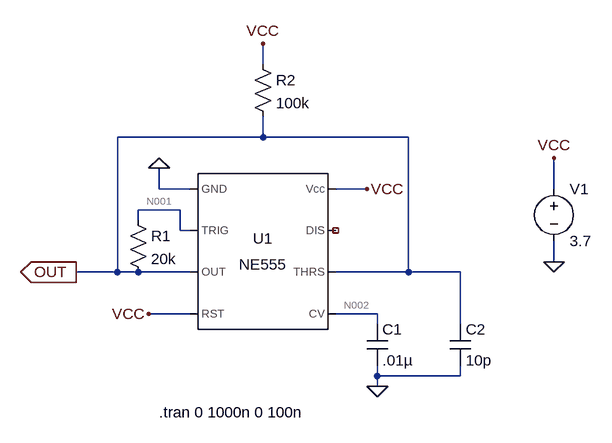
[diagram p0: schematic Draft1.asc]
Draft1.asc, the LTspice schematic file:
Version 4
SHEET 1 880 680
WIRE 208 -128 208 -160
WIRE 208 -16 208 -48
WIRE 208 -16 -16 -16
WIRE 432 -16 208 -16
WIRE 48 64 48 32
WIRE 96 64 48 64
WIRE 368 64 320 64
WIRE 656 64 656 16
WIRE 80 96 16 96
WIRE 16 112 16 96
WIRE 80 128 80 96
WIRE 96 128 80 128
WIRE 656 176 656 144
WIRE -16 192 -16 -16
WIRE -16 192 -80 192
WIRE 16 192 -16 192
WIRE 96 192 16 192
WIRE 432 192 432 -16
WIRE 432 192 320 192
WIRE 512 192 432 192
WIRE 96 256 32 256
WIRE 384 256 320 256
WIRE 384 272 384 256
WIRE 512 272 512 192
WIRE 384 352 384 336
WIRE 512 352 512 336
WIRE 512 352 384 352
WIRE 384 368 384 352
FLAG 384 368 0
FLAG 656 176 0
FLAG 656 16 VCC
FLAG 368 64 VCC
FLAG 32 256 VCC
FLAG -80 192 OUT
IOPIN -80 192 Out
FLAG 48 32 0
FLAG 208 -160 VCC
SYMBOL Misc\\NE555 208 160 R0
SYMATTR InstName U1
SYMBOL cap 368 272 R0
SYMATTR InstName C1
SYMATTR Value .01µ
SYMBOL cap 496 272 R0
SYMATTR InstName C2
SYMATTR Value 10p
SYMBOL voltage 656 48 R0
WINDOW 123 0 0 Left 0
WINDOW 39 0 0 Left 0
SYMATTR InstName V1
SYMATTR Value 3.7
SYMBOL res 0 96 R0
SYMATTR InstName R1
SYMATTR Value 20k
SYMBOL res 192 -144 R0
SYMATTR InstName R2
SYMATTR Value 100k
TEXT 48 408 Left 2 !.tran 0 1000n 0 100n

The netlist it stands for:
* Draft1.asc
XU1 0 N001 OUT VCC N002 OUT NC_01 VCC NE555  ; pins GND TRIG OUT RST CV THRS DIS Vcc
C1 N002 0 .01µ
C2 OUT 0 10p
V1 VCC 0 3.7
R1 N001 OUT 20k
R2 VCC OUT 100k
.tran 0 1000n 0 100n
.lib NE555.sub
.backanno
.end

* Results of the author's LTspice run, read from the files saved beside the schematic
* Operating Point, zero values left out:
*   V(n001) = 3.7 V
*   V(n002) = 2.467 V
*   V(vcc) = 3.7 V
*   V(out) = 3.7 V
*   I(R1) = -3.7 nA
*   I(R2) = 222.4 pA
*   I(V1) = -1.189 mA
*   Ix(u1:1) = -1.189 mA
*   Ix(u1:2) = 3.7 nA
*   Ix(u1:3) = -7.177 nA
*   Ix(u1:4) = 14 µA
*   Ix(u1:6) = 3.7 nA
*   Ix(u1:8) = 1.175 mA
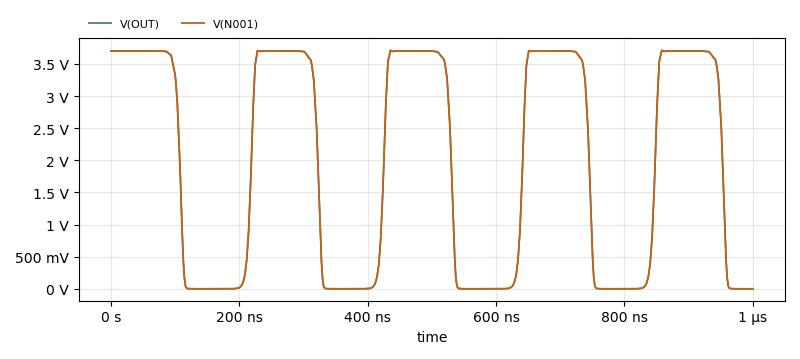
[diagram p1: Transient Analysis of Draft1.asc, plotted from the saved traces]
* Transient Analysis, 1 run:
*   V(OUT): min 244 µV, max 3.712 V, average 1.951 V, rms 2.62 V, last 244 µV
*   V(N001): min 244 µV, max 3.712 V, average 1.951 V, rms 2.62 V, last 244 µV